# Altium schematic sheet Sch.SchDoc
size A4
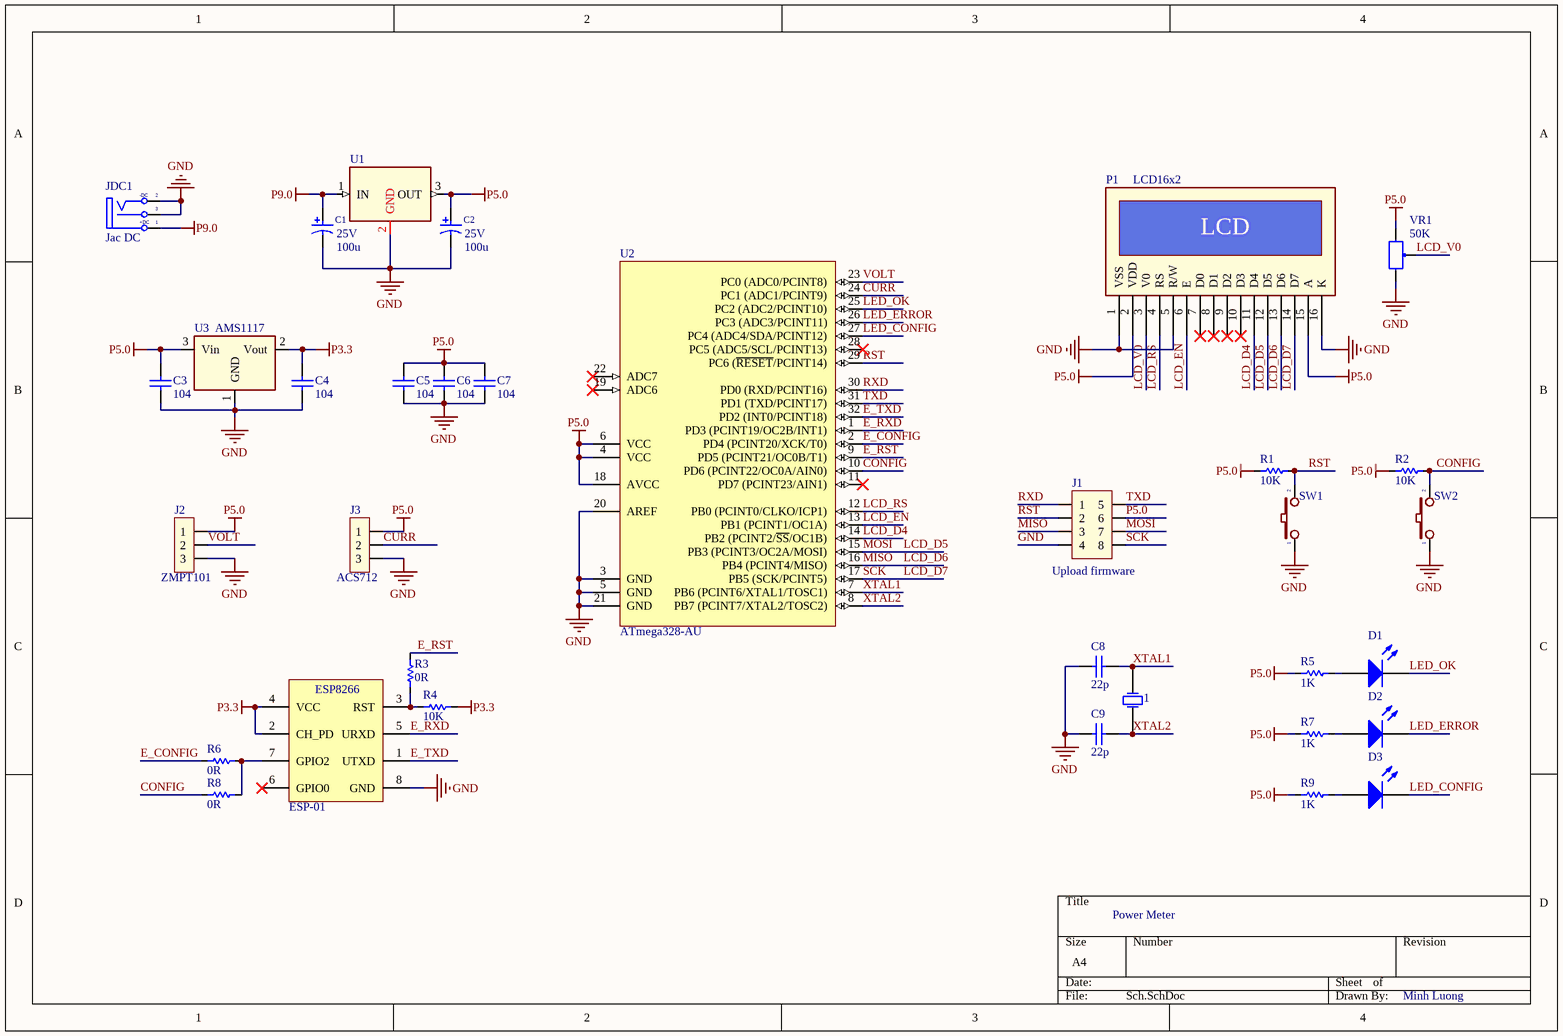
[diagram p0: Sch.SchDoc]

## Parts
1  XTAL  [XTAL]  (value not drawn)
C1  Volt: 25V  [CAP_SMD_6_3MM]  (hidden comment: 100u)
C2  Volt: 25V  [CAP_SMD_6_3MM]  (hidden comment: 100u)
C3  value 104  [CAP_SMD_0805]  (hidden comment: Cap Non-pol)
C4  value 104  [CAP_SMD_0805]  (hidden comment: Cap Non-pol)
C5  value 104  [CAP_SMD_0805]  (hidden comment: Cap Non-pol)
C6  value 104  [CAP_SMD_0805]  (hidden comment: Cap Non-pol)
C7  value 104  [CAP_SMD_0805]  (hidden comment: Cap Non-pol)
C8  value 22p  [CAP_SMD_0805]  (hidden comment: Cap Non-pol)
C9  value 22p  [CAP_SMD_0805]  (hidden comment: Cap Non-pol)
D1  LED  [LED-0805 GREEN]  (value not drawn)
D2  LED  [LED-0805 RED]  (value not drawn)
D3  LED  [LED-0805 BLUE]  (value not drawn)
J1  Upload firmware  [JP4x2]
J2  ZMPT101  [JP3]
J3  ACS712  [JP3]
JDC1  Jac DC  [DC-IN]
P1  LCD16x2  [LCD16x2]
R1  value 10K  [RES_SMD_0805]  (hidden comment: RESISTOR)
R2  value 10K  [RES_SMD_0805]  (hidden comment: RESISTOR)
R3  value 0R  [RES_SMD_0805]  (hidden comment: RESISTOR)
R4  value 10K  [RES_SMD_0805]  (hidden comment: RESISTOR)
R5  value 1K  [RES_SMD_0805]  (hidden comment: RESISTOR)
R6  value 0R  [RES_SMD_0805]  (hidden comment: RESISTOR)
R7  value 1K  [RES_SMD_0805]  (hidden comment: RESISTOR)
R8  value 0R  [RES_SMD_0805]  (hidden comment: RESISTOR)
R9  value 1K  [RES_SMD_0805]  (hidden comment: RESISTOR)
SW1  SW  [SW2]  (value not drawn)
SW2  SW  [SW2]  (value not drawn)
U1  LM78xx  [TO-263]  (value not drawn)
U2  ATmega328-AU  [TQFP32A]
U3  AMS1117  [SOT223]
U4  ESP-01  [ESP8266]
VR1  50K  [VR]

## Nets
GND: C1.2 C2.2 C3.1 C4.1 C5.1 C6.1 C7.1 C8.1 C9.1 J1.4 J2.3 J3.3 JDC1.2(TN) JDC1.3(S) P1.1(VSS) P1.5(R/W) P1.16(K) SW1.1 SW2.1 U1.2(GND) U2.3(GND) U2.5(GND) U2.20(AREF) U2.21(GND) U3.1(GND) U4.8(GND) VR1.3
P3.3: C4.2 R4.1 U3.2(Vout) U4.2(CH_PD) U4.4(VCC)
P5.0: C2.1 C3.2 C5.2 C6.2 C7.2 J1.6 J2.1 J3.1 P1.2(VDD) P1.15(A) R1.2 R2.2 R5.2 R7.2 R9.2 U1.3(OUT) U2.4(VCC) U2.6(VCC) U2.18(AVCC) U3.3(Vin) VR1.1
P9.0: C1.1 JDC1.1(T) U1.1(IN)
CONFIG: R2.1 R8.1 SW2.2 U2.10(PD6_(PCINT22/OC0A/AIN0))
CURR: J3.2 U2.24(PC1_(ADC1/PCINT9))
E_CONFIG: R6.1 U2.2(PD4_(PCINT20/XCK/T0))
E_RST: R3.1 U2.9(PD5_(PCINT21/OC0B/T1))
E_RXD: U2.1(PD3_(PCINT19/OC2B/INT1)) U4.5(URXD)
E_TXD: U2.32(PD2_(INT0/PCINT18)) U4.1(UTXD)
LCD_D4: P1.11(D4) U2.14(PB2_(PCINT2/~{SS}/OC1B))
LCD_D5: J1.7 P1.12(D5) U2.15(PB3_(PCINT3/OC2A/MOSI))  [also labelled MOSI]
LCD_D6: J1.3 P1.13(D6) U2.16(PB4_(PCINT4/MISO))  [also labelled MISO]
LCD_D7: J1.8 P1.14(D7) U2.17(PB5_(SCK/PCINT5))  [also labelled SCK]
LCD_EN: P1.6(E) U2.13(PB1_(PCINT1/OC1A))
LCD_RS: P1.4(RS) U2.12(PB0_(PCINT0/CLKO/ICP1))
LCD_V0: P1.3(V0) VR1.2
LED_CONFIG: D3.2(K) U2.27(PC4_(ADC4/SDA/PCINT12))
LED_ERROR: D2.2(K) U2.26(PC3_(ADC3/PCINT11))
LED_OK: D1.2(K) U2.25(PC2_(ADC2/PCINT10))
RST: J1.2 R1.1 SW1.2 U2.29(PC6_(~{RESET}/PCINT14))
RXD: J1.1 U2.30(PD0_(RXD/PCINT16))
TXD: J1.5 U2.31(PD1_(TXD/PCINT17))
VOLT: J2.2 U2.23(PC0_(ADC0/PCINT8))
XTAL1: 1.2(OSC2) C8.2 U2.7(PB6_(PCINT6/XTAL1/TOSC1))
XTAL2: 1.1(OSC1) C9.2 U2.8(PB7_(PCINT7/XTAL2/TOSC2))
NetD1_1: D1.1(A) R5.1
NetD2_1: D2.1(A) R7.1
NetD3_1: D3.1(A) R9.1
NetR3_2: R3.2 R4.2 U4.3(RST)
NetR6_2: R6.2 R8.2 U4.7(GPIO2)

Not connected (* = marked no-connect by the designer): P1 7(D0)* 8(D1)* 9(D2)* 10(D3)*; U2 11(PD7_(PCINT23/AIN1))* 19(ADC6)* 22(ADC7)* 28(PC5_(ADC5/SCL/PCINT13))*; U4 6(GPIO0)*

## Notes on the sheet
- Power Meter
- Minh Luong
- (in symbol DCIN) -DC; +DC
- (in symbol ESP8266-01) ESP8266
- (in symbol LCD Text) LCD

## Library data of the parts
1 = XTAL: Crystal Oscillator; Published: 8-Jun-2000; LatestRevisionDate: 17-Jul-2002; LatestRevisionNote: Re-released for DXP Platform.; PackageReference: R38; Publisher: Altium Limited
C1 C2 = Cap_Pol: Polarized Capacitor; Manufacturer: FARNELL; AEMS Code: 2100110; Vendor: Digikey; Capacitor Type: Tant; Published: 13-April-2009; Publisher: Hoang Nguyen; ComponentLink1Description: Digikey Part Link; ComponentLink2Description: Open Datasheet; ComponentLink2URL: H:\LIBRARY\LIBRARY.Datasheet\; Value: 100u
C3-C9 = Cap Non-pol: Non-polarized Capacitor; LatestRevisionNote: Re-released for DXP Platform.; PackageReference: RAD-0.3; Publisher: Altium Limited
D1-D3 = LED: Typical LED; Published: 8-Jun-2000; LatestRevisionDate: 08-Jul-2005; LatestRevisionNote: Mech Layer 1 removed.; PackageReference: LED-1; Publisher: Altium Limited
J1 = JP4x2: Connector 4x2; Value: Connector 4x2
J2 J3 = JP3: Jumper 3; Value: J3
JDC1 = DCIN: Jac DC input; Value: Jac DC
P1 = LCD Text
SW1 SW2 = SW2: Switch button 2 pin; Value: SW chip 2 pin
U1 = LM78xx: Regulator; Manufacturer: Fairchild Semiconductor Corporation; PSpiceTemplate: X^@REFDES %IN %OUT %GND @MODEL; Vendor: Digikey; Output Current: Up to 1A; V out: 5V; Tolerance: 4 %; Value: LM7805CT; Published: 13-April-2009; Publisher: Hoang Nguyen; ComponentLink1Description: Digikey Part Link; ComponentLink2Description: Open Datasheet; ComponentLink2URL: H:\LIBRARY\LIBRARY.Datasheet\LM7805.pdf; Price: 2500 VND
U2 = ATmega328-AU: 8-bit AVR Microcontroller, 32KB Flash, 1KB EEPROM, 2KB SRAM, 32-pin TQFP, Industrial Grade (-40°C to 85°C)
U3 = AMS1117: Regulator SMD Chip; Designed By: John MacTavish; Vendor: Digikey; ComponentLink1Description: Digikey Part Link; ComponentLink2Description: Open Datasheet; ComponentLink2URL: H:\LIBRARY\LIBRARY.Datasheet\
U4 = ESP8266-01: ESP-12 Wi-Fi Module
VR1 = VR: Var Resistor; Value: VR 10K
R1-R9 = RESISTOR: Published: 8-Jun-2000; LatestRevisionDate: 17-Jul-2002; LatestRevisionNote: Re-released for DXP Platform.; PackageReference: AXIAL-0.3; Publisher: Altium Limited